# Altium schematic sheet connector.SchDoc: TITLE
size A4; Author: AUTHOR; Organization: Develer s.r.l.; Address1: via Mugellese 1/A; Address2: 50019 Campi Bisenzio; Address3: Firenze; Address4: ITALY; Revision: A; SheetNumber: 1; SheetTotal: 1; Hw_rev: R1
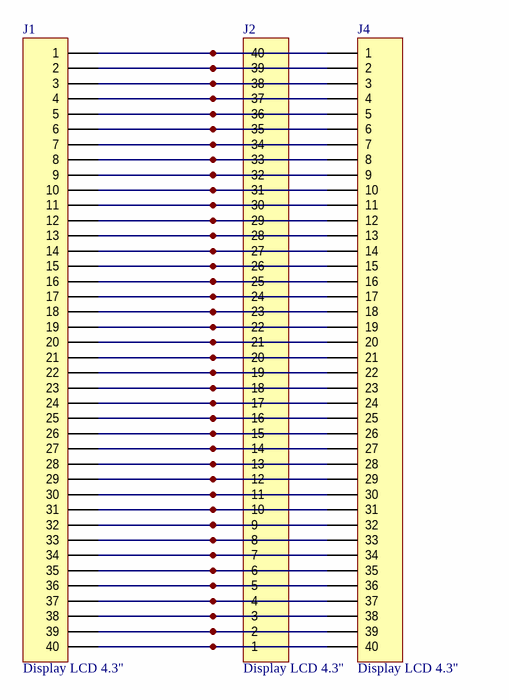
[diagram p0: connector.SchDoc]

## Parts
J1  Display LCD 4.3''  [fcc-zif_40pin_0.5mm]
J2  Display LCD 4.3''  [fcc-zif_40pin_0.5mm]
J4  Display LCD 4.3''  [fcc-zif_40pin_0.5mm]

## Nets
NetJ1_1: J1.1 J2.40 J4.1
NetJ1_2: J1.2 J2.39 J4.2
NetJ1_3: J1.3 J2.38 J4.3
NetJ1_4: J1.4 J2.37 J4.4
NetJ1_5: J1.5 J2.36 J4.5
NetJ1_6: J1.6 J2.35 J4.6
NetJ1_7: J1.7 J2.34 J4.7
NetJ1_8: J1.8 J2.33 J4.8
NetJ1_9: J1.9 J2.32 J4.9
NetJ1_10: J1.10 J2.31 J4.10
NetJ1_11: J1.11 J2.30 J4.11
NetJ1_12: J1.12 J2.29 J4.12
NetJ1_13: J1.13 J2.28 J4.13
NetJ1_14: J1.14 J2.27 J4.14
NetJ1_15: J1.15 J2.26 J4.15
NetJ1_16: J1.16 J2.25 J4.16
NetJ1_17: J1.17 J2.24 J4.17
NetJ1_18: J1.18 J2.23 J4.18
NetJ1_19: J1.19 J2.22 J4.19
NetJ1_20: J1.20 J2.21 J4.20
NetJ1_21: J1.21 J2.20 J4.21
NetJ1_22: J1.22 J2.19 J4.22
NetJ1_23: J1.23 J2.18 J4.23
NetJ1_24: J1.24 J2.17 J4.24
NetJ1_25: J1.25 J2.16 J4.25
NetJ1_26: J1.26 J2.15 J4.26
NetJ1_27: J1.27 J2.14 J4.27
NetJ1_28: J1.28 J2.13 J4.28
NetJ1_29: J1.29 J2.12 J4.29
NetJ1_30: J1.30 J2.11 J4.30
NetJ1_31: J1.31 J2.10 J4.31
NetJ1_32: J1.32 J2.9 J4.32
NetJ1_33: J1.33 J2.8 J4.33
NetJ1_34: J1.34 J2.7 J4.34
NetJ1_35: J1.35 J2.6 J4.35
NetJ1_36: J1.36 J2.5 J4.36
NetJ1_37: J1.37 J2.4 J4.37
NetJ1_38: J1.38 J2.3 J4.38
NetJ1_39: J1.39 J2.2 J4.39
NetJ1_40: J1.40 J2.1 J4.40

## Notes on the sheet
- Title:
- Project:
- Status:
- Author:
- License:
- Rev:
- Size:
- A4
- File:
- Date:
- Time:
- Sheet
- of

## Library data of the parts
J1 J2 J4 = Header 40: 40-pin, 0.5mm, SMT, ZIF, Horizontal, Top Contact (WE 68714014022; Molex: 54104-4031); LatestRevisionDate: 17-Jul-2002; LatestRevisionNote: Re-released for DXP Platform.; Publisher: Altium Limited